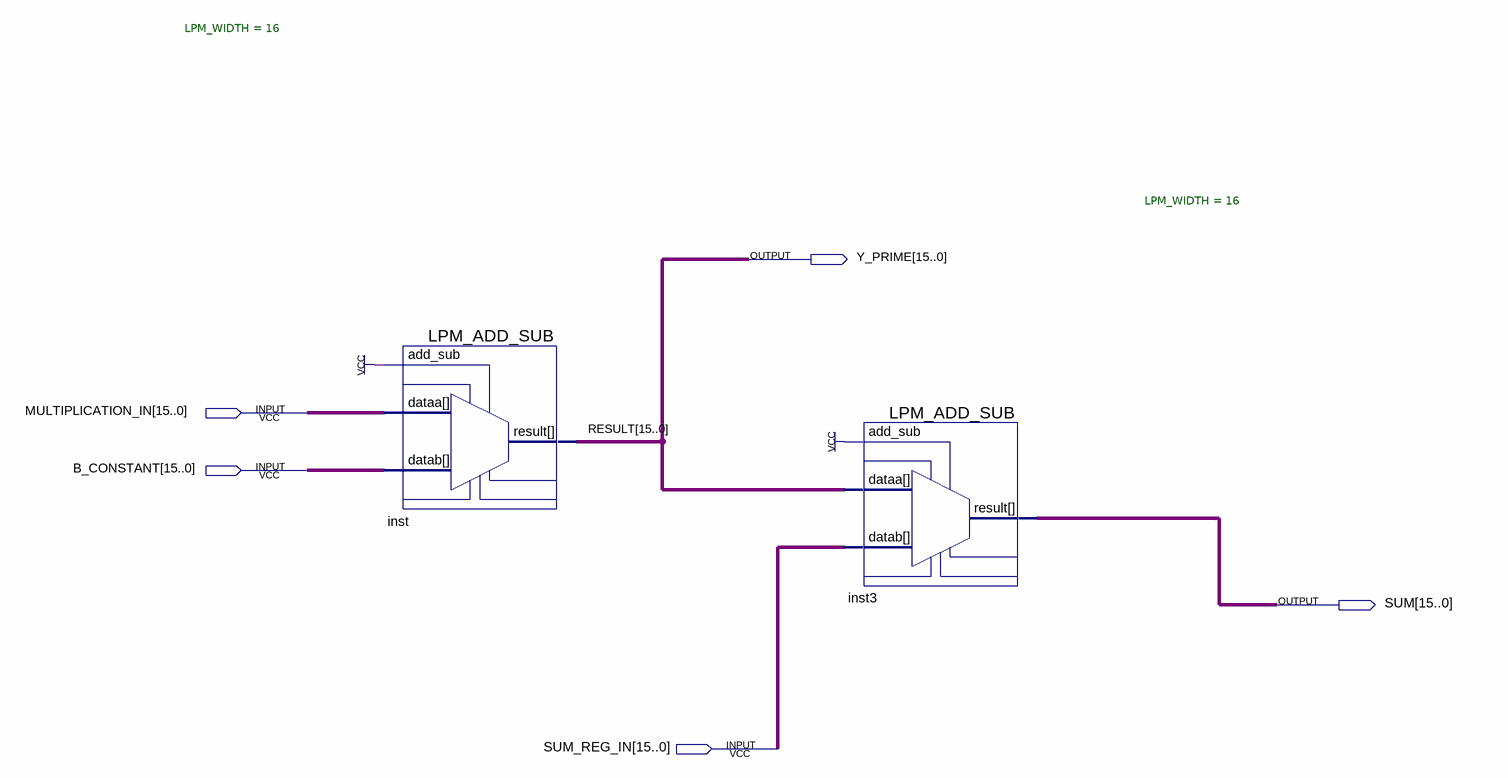
[diagram p0: schematic sheet]
// Quartus schematic RNDC_FINAL_Y_AND_FINAL_SUM_CALCULATOR.bdf as structural Verilog: 2 symbols, 5 pins
module RNDC_FINAL_Y_AND_FINAL_SUM_CALCULATOR (
  input  [15:0] MULTIPLICATION_IN,
  input  [15:0] B_CONSTANT,
  input  [15:0] SUM_REG_IN,
  output [15:0] Y_PRIME,
  output [15:0] SUM
);

  LPM_ADD_SUB #(.LPM_WIDTH(16)) inst (.add_sub(1'b1), .dataa(MULTIPLICATION_IN), .datab(B_CONSTANT), .result(Y_PRIME));
  LPM_ADD_SUB #(.LPM_WIDTH(16)) inst3 (.add_sub(1'b1), .dataa(Y_PRIME), .datab(SUM_REG_IN), .result(SUM));

  // Other names for the same wires on the sheet: RESULT[15:0] = Y_PRIME
endmodule
